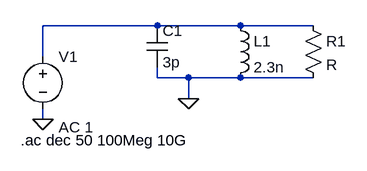
[diagram p0: schematic Draft2.asc]
Draft2.asc, the LTspice schematic file:
Version 4
SHEET 1 880 680
WIRE 160 176 -16 176
WIRE 288 176 160 176
WIRE 400 176 288 176
WIRE -16 224 -16 176
WIRE 160 256 160 240
WIRE 208 256 160 256
WIRE 288 256 208 256
WIRE 400 256 288 256
WIRE 208 288 208 256
WIRE -16 320 -16 304
FLAG 208 288 0
FLAG -16 320 0
SYMBOL cap 144 176 R0
SYMATTR InstName C1
SYMATTR Value 3p
SYMBOL ind 272 160 R0
SYMATTR InstName L1
SYMATTR Value 2.3n
SYMBOL voltage -16 208 R0
WINDOW 123 24 124 Left 2
WINDOW 39 0 0 Left 0
SYMATTR InstName V1
SYMATTR Value ""
SYMATTR Value2 AC 1
SYMBOL res 384 160 R0
SYMATTR InstName R1
TEXT -50 352 Left 2 !.ac dec 50 100Meg 10G

The netlist it stands for:
* Draft2.asc
C1 N001 0 3p
L1 N001 0 2.3n
V1 N001 0 AC 1
R1 N001 0 R
.ac dec 50 100Meg 10G
.backanno
.end